# Altium schematic sheet RoboticArm_DevBoard.SchDoc: RoboticArm DevBoard
size 420 x 297 mm; Date: 11/05/25; ApprovedBy: Waibl Leonhard; CheckedBy: Waibl Leonhard; Author: Waibl Leonhard; CompanyName: TFO Meran; DrawnBy: Waibl Leonhard; Engineer: Waibl Leonhard; Organization: TFO Meran; Address1: Karl-Wolf-Straße; Address2: 36; Address3: 39012; Address4: Meran (BZ); DocumentNumber: 1; Revision: 2; SheetNumber: 1; SheetTotal: 8; Project: HobbyBot; ENG_APP_DATE: 11/05/25; DSN_APP_DATE: 11/05/25; CHK_APP_DATE: 11/05/25; ProjectRevision: 2; DocumentRevision: 3; ImagePath: C:\Users\Public\Documents\Altium\RoboticArm_DevBoard_V2\images\tfo_logo.jpg; Application_BuildNumber: 2
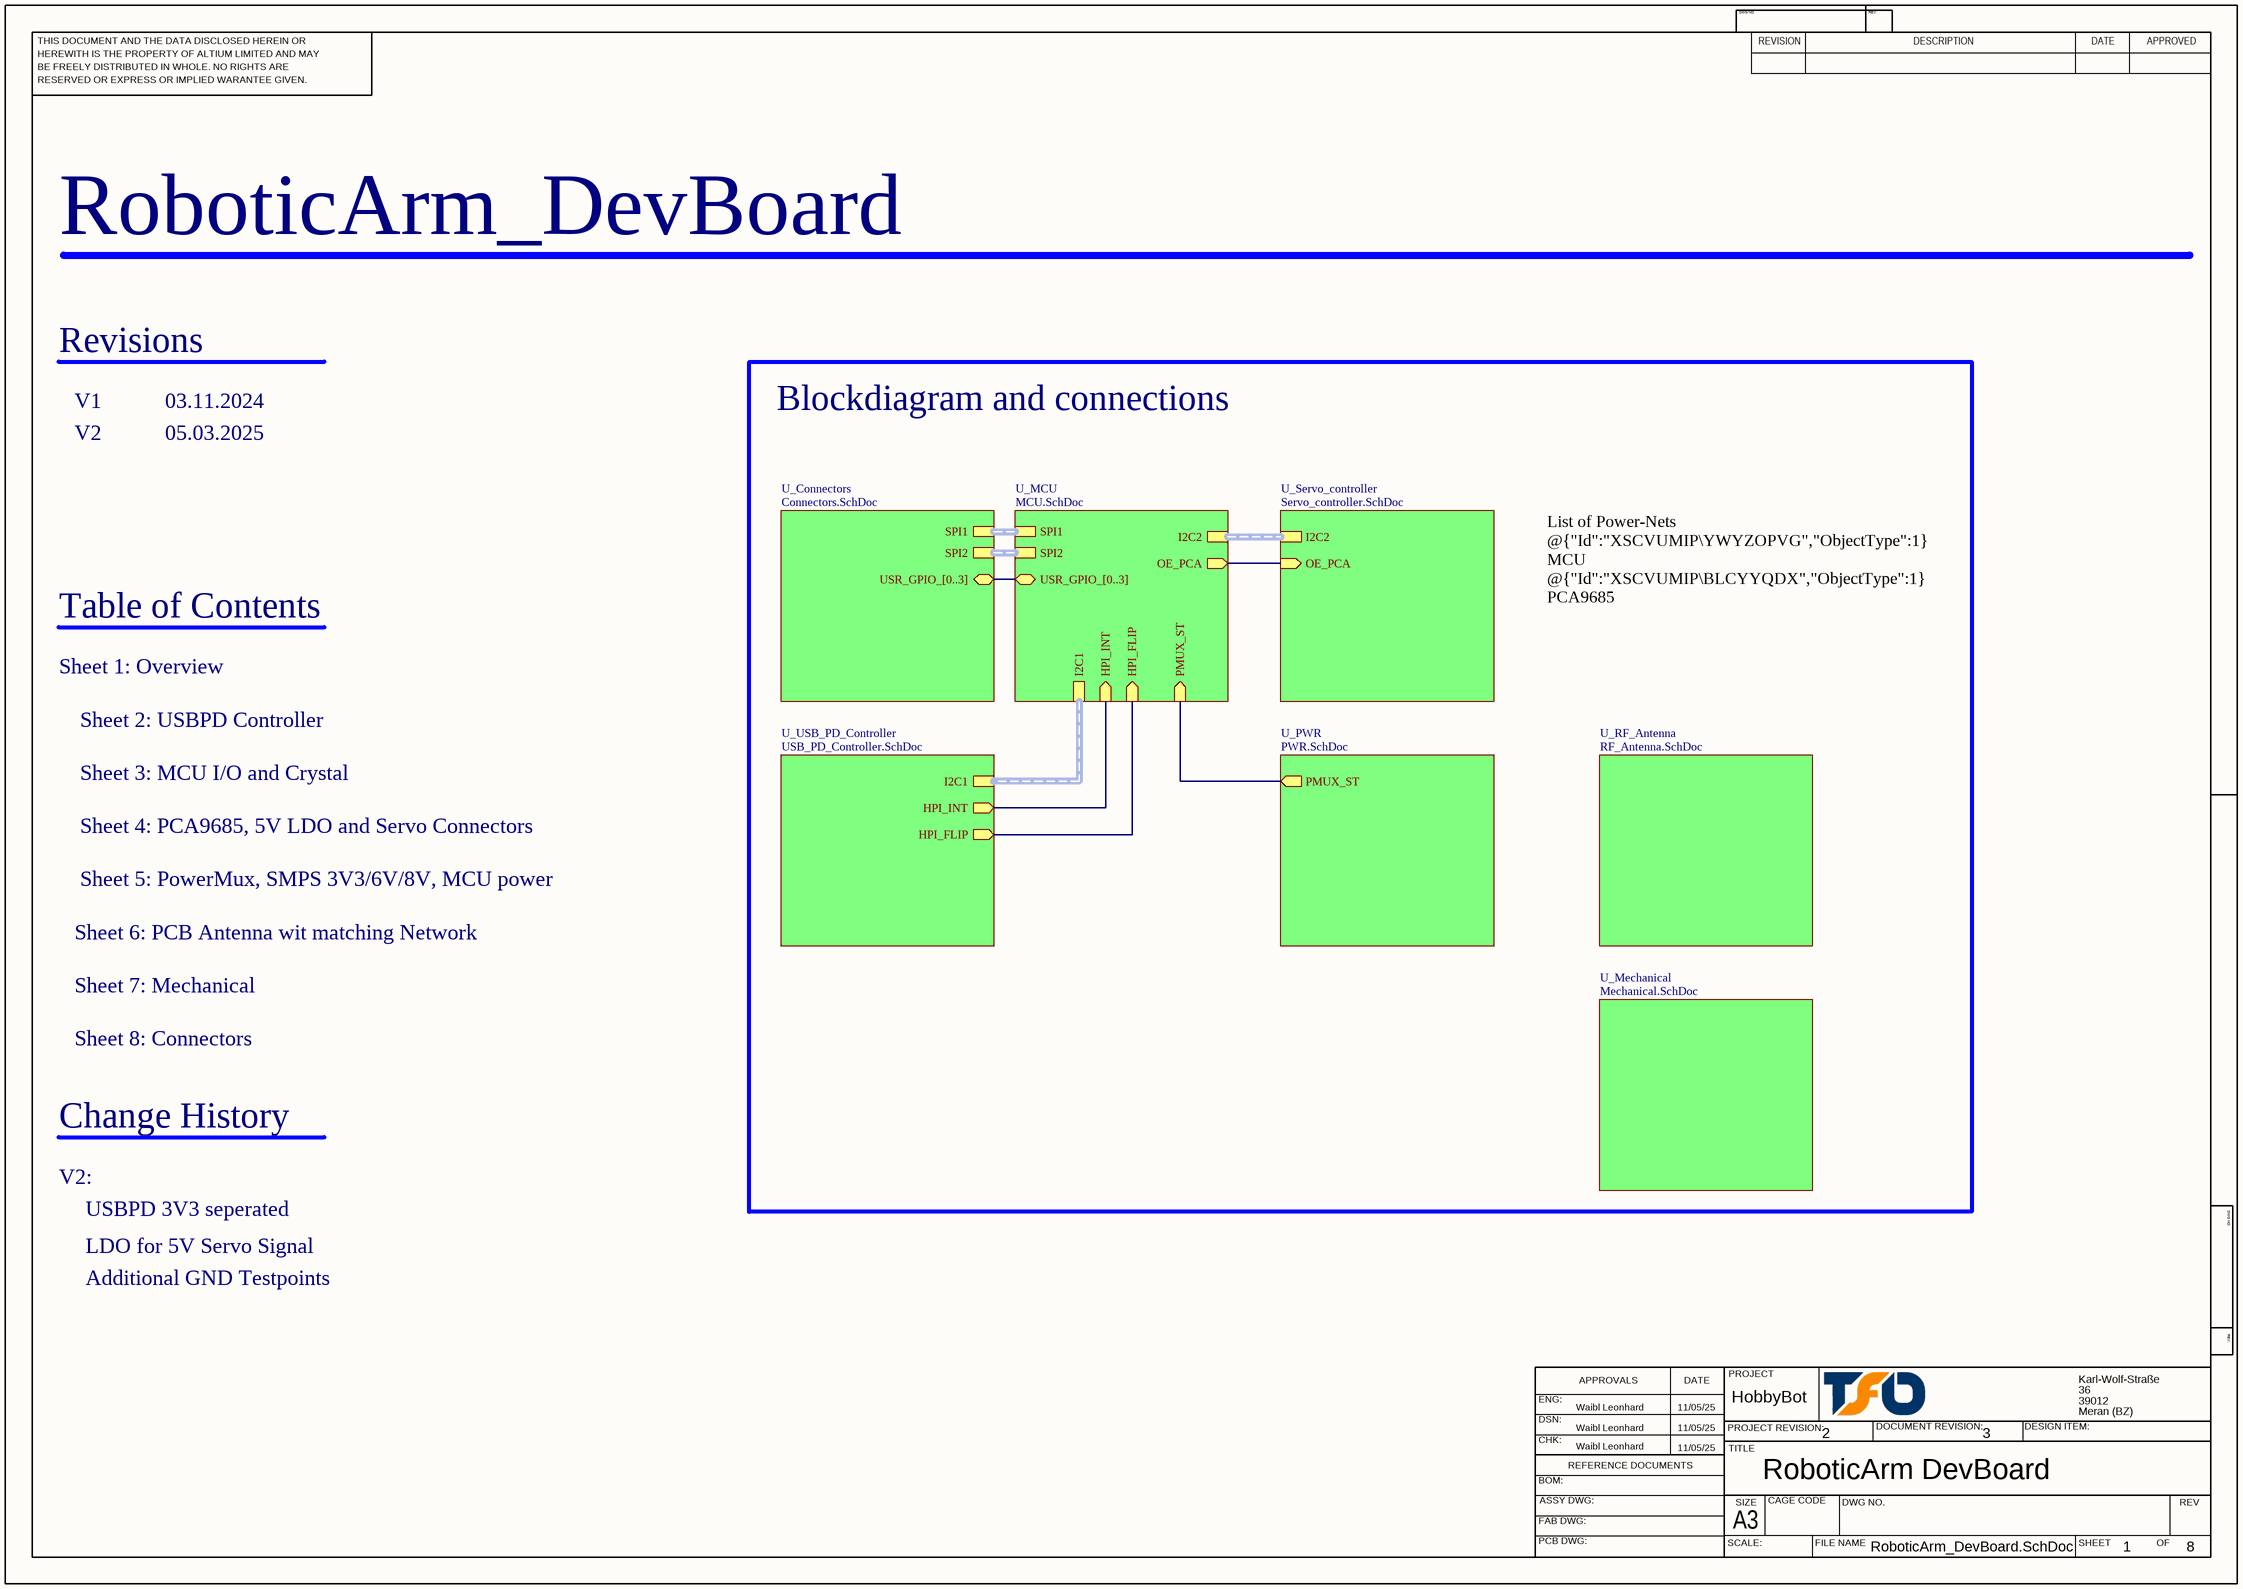
[diagram p0: RoboticArm_DevBoard.SchDoc]

## Sub-sheets
U_Connectors = Connectors.SchDoc: SPI1 (harness SPI), SPI2 (harness SPI), USR_GPIO_[0..3] (bidir)
U_MCU = MCU.SchDoc: SPI1 (harness *), SPI2 (harness *), I2C1 (harness *), OE_PCA (out), I2C2 (harness *), HPI_FLIP (in), HPI_INT (in), PMUX_ST (in), USR_GPIO_[0..3] (bidir)
U_Mechanical = Mechanical.SchDoc: no entries
U_PWR = PWR.SchDoc: PMUX_ST (out)
U_RF_Antenna = RF_Antenna.SchDoc: no entries
U_Servo_controller = Servo_controller.SchDoc: I2C2 (harness *), OE_PCA (in)
U_USB_PD_Controller = USB_PD_Controller.SchDoc: I2C1 (harness *), HPI_INT (out), HPI_FLIP (out)

## Nets
(unnamed): sheet U_MCU/OE_PCA, sheet U_Servo_controller/OE_PCA
(unnamed): sheet U_MCU/HPI_FLIP, sheet U_USB_PD_Controller/HPI_FLIP
(unnamed): sheet U_MCU/HPI_INT, sheet U_USB_PD_Controller/HPI_INT
(unnamed): sheet U_MCU/PMUX_ST, sheet U_PWR/PMUX_ST

## Buses and harness runs
bus sheet U_Connectors/USR_GPIO_[0..3] = sheet U_MCU/USR_GPIO_[0..3]
harness sheet U_Connectors/SPI1 = sheet U_MCU/SPI1
harness sheet U_Connectors/SPI2 = sheet U_MCU/SPI2
harness sheet U_MCU/I2C1 = sheet U_USB_PD_Controller/I2C1
harness sheet U_MCU/I2C2 = sheet U_Servo_controller/I2C2

## Notes on the sheet
- RoboticArm_DevBoard
- Revisions
- V1
- V2
- 03.11.2024
- 05.03.2025
- Blockdiagram and connections
- Table of Contents
- List of Power-Nets
  @{"Id":"XSCVUMIP\YWYZOPVG","ObjectType":1} MCU
  @{"Id":"XSCVUMIP\BLCYYQDX","ObjectType":1} PCA9685
  @{"Id":"YYHNZXNY\TMXGGDOU","ObjectType":1} Servos
  @{"Id":"YYHNZXNY\GFYATLQU","ObjectType":1} Servos
- Sheet 1: Overview
- Sheet 2: USBPD Controller
- Sheet 3: MCU I/O and Crystal
- Sheet 4: PCA9685, 5V LDO and Servo Connectors
- Sheet 5: PowerMux, SMPS 3V3/6V/8V, MCU power
- Sheet 6: PCB Antenna wit matching Network
- Sheet 7: Mechanical
- Sheet 8: Connectors
- Change History
- V2:
- USBPD 3V3 seperated
- LDO for 5V Servo Signal
- Additional GND Testpoints
- THIS DOCUMENT AND THE DATA DISCLOSED HEREIN OR
- HEREWITH IS THE PROPERTY OF ALTIUM LIMITED AND MAY
- DWG NO:
- REVISION
- REV:
- DESCRIPTION
- DATE
- APPROVED
- BE FREELY DISTRIBUTED IN WHOLE. NO RIGHTS ARE
- RESERVED OR EXPRESS OR IMPLIED WARANTEE GIVEN.
- ENG:
- APPROVALS
- PROJECT
- DSN:
- CHK:
- REFERENCE DOCUMENTS
- PROJECT REVISION:
- TITLE
- DOCUMENT REVISION:
- DESIGN ITEM:
- BOM:
- FAB DWG:
- PCB DWG:
- ASSY DWG:
- SCALE:
- A3
- SIZE
- CAGE CODE
- FILE NAME
- DWG NO.
- SHEET
- OF
- REV